# Altium schematic sheet Сторона печтаного монтажа А4.SchDoc
size 209 x 297 mm; Address1: Address1; Address2: Address2; Address3: Address3; Address4: Address4; SheetNumber: 1; Scale: 1:1
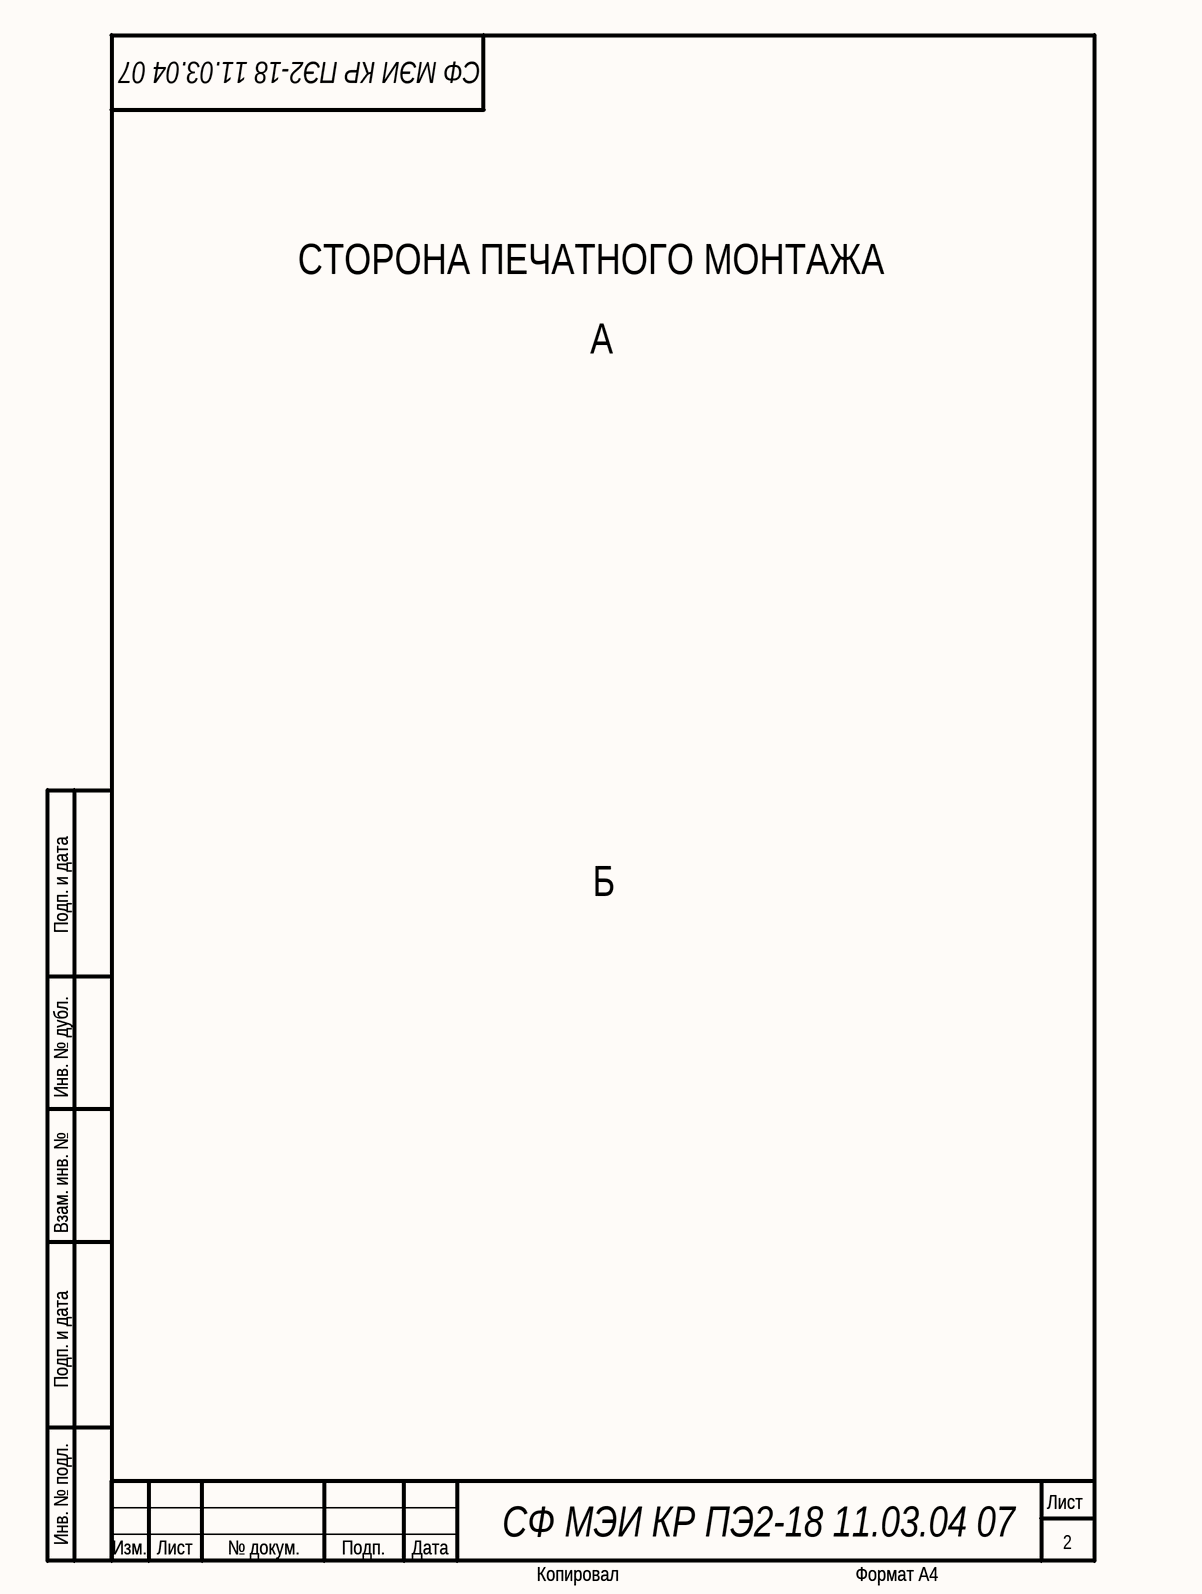
[diagram p0: Сторона печтаного монтажа А4.SchDoc]

## Notes on the sheet
- СФ МЭИ КР ПЭ2-18 11.03.04 07
- СТОРОНА ПЕЧАТНОГО МОНТАЖА
- А
- Подп. и дата
- Б
- Инв. № дубл.
- Взам. инв. №
- Инв. № подл.
- Изм.
- Лист
- № докум.
- Подп.
- Дата
- 2
- Копировал
- Формат А4